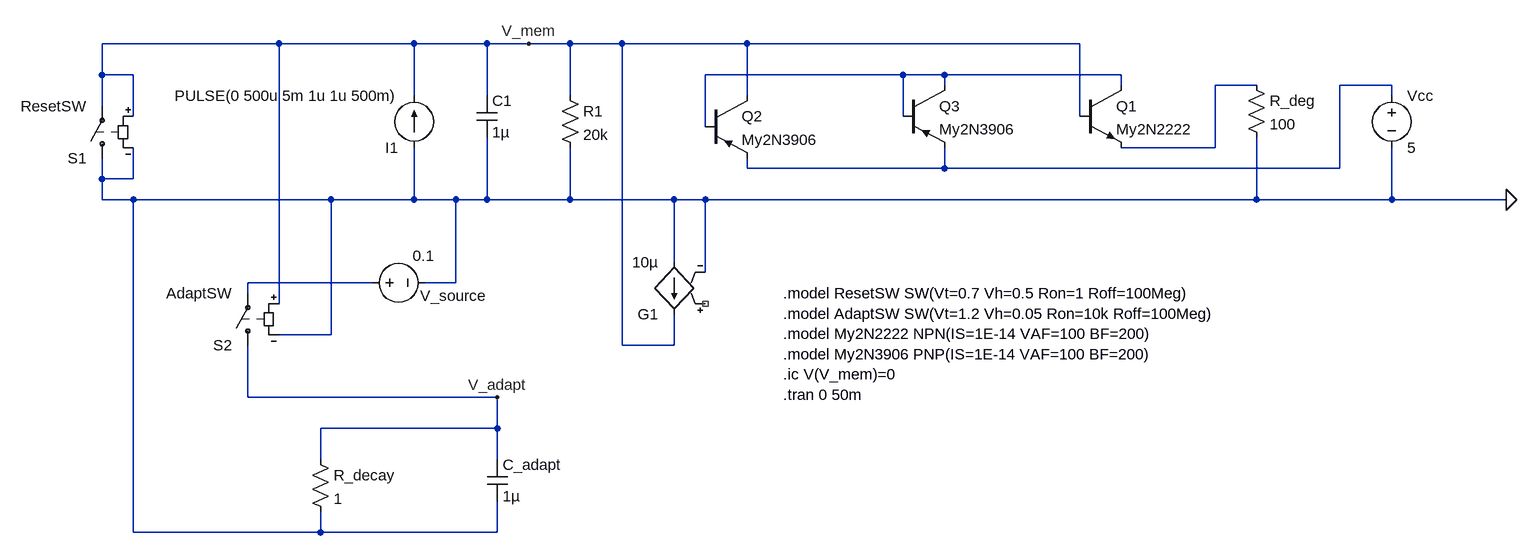
[diagram p0: schematic Adaptative_Neuron.asc]
Adaptative_Neuron.asc, the LTspice schematic file:
Version 4
SHEET 1 2152 2104
WIRE -1552 1344 -1824 1344
WIRE -1344 1344 -1552 1344
WIRE -1232 1344 -1344 1344
WIRE -1168 1344 -1232 1344
WIRE -1104 1344 -1168 1344
WIRE -1024 1344 -1104 1344
WIRE -832 1344 -1024 1344
WIRE -320 1344 -832 1344
WIRE -1824 1392 -1824 1344
WIRE -1776 1392 -1824 1392
WIRE -592 1392 -896 1392
WIRE -528 1392 -592 1392
WIRE -256 1392 -528 1392
WIRE -528 1408 -528 1392
WIRE -256 1408 -256 1392
WIRE -48 1408 -112 1408
WIRE 160 1408 80 1408
WIRE -1344 1424 -1344 1344
WIRE -1232 1424 -1232 1344
WIRE -1104 1424 -1104 1344
WIRE -832 1424 -832 1344
WIRE 160 1424 160 1408
WIRE -1824 1440 -1824 1392
WIRE -1776 1456 -1776 1392
WIRE -592 1456 -592 1392
WIRE -320 1456 -320 1344
WIRE -896 1472 -896 1392
WIRE -112 1504 -112 1408
WIRE -112 1504 -256 1504
WIRE -832 1536 -832 1520
WIRE -528 1536 -528 1504
WIRE -528 1536 -832 1536
WIRE 80 1536 80 1408
WIRE 80 1536 -528 1536
WIRE -1824 1552 -1824 1520
WIRE -1776 1552 -1776 1504
WIRE -1776 1552 -1824 1552
WIRE -1824 1584 -1824 1552
WIRE -1776 1584 -1824 1584
WIRE -1472 1584 -1776 1584
WIRE -1344 1584 -1344 1504
WIRE -1344 1584 -1472 1584
WIRE -1280 1584 -1344 1584
WIRE -1232 1584 -1232 1488
WIRE -1232 1584 -1280 1584
WIRE -1104 1584 -1104 1504
WIRE -1104 1584 -1232 1584
WIRE -944 1584 -1104 1584
WIRE -896 1584 -944 1584
WIRE -48 1584 -48 1488
WIRE -48 1584 -896 1584
WIRE 160 1584 160 1504
WIRE 160 1584 -48 1584
WIRE 336 1584 160 1584
WIRE -944 1680 -944 1584
WIRE -896 1696 -896 1584
WIRE -1408 1712 -1600 1712
WIRE -1280 1712 -1280 1584
WIRE -1280 1712 -1328 1712
WIRE -1600 1728 -1600 1712
WIRE -1552 1744 -1552 1344
WIRE -1472 1792 -1472 1584
WIRE -1472 1792 -1552 1792
WIRE -1024 1808 -1024 1344
WIRE -944 1808 -944 1760
WIRE -944 1808 -1024 1808
WIRE -1600 1888 -1600 1808
WIRE -1216 1888 -1600 1888
WIRE -1216 1936 -1216 1888
WIRE -1216 1936 -1488 1936
WIRE -1488 1984 -1488 1936
WIRE -1216 1984 -1216 1936
WIRE -1776 2096 -1776 1584
WIRE -1488 2096 -1488 2064
WIRE -1488 2096 -1776 2096
WIRE -1216 2096 -1216 2048
WIRE -1216 2096 -1488 2096
FLAG 336 1584 0
FLAG -1216 1888 V_adapt
FLAG -1168 1344 V_mem
SYMBOL cap -1248 1424 R0
SYMATTR InstName C1
SYMATTR Value 1µ
SYMBOL res -1120 1408 R0
SYMATTR InstName R1
SYMATTR Value 20k
SYMBOL current -1344 1504 R180
WINDOW 123 0 0 Left 0
WINDOW 39 0 0 Left 0
SYMATTR InstName I1
SYMATTR Value PULSE(0 500u 5m 1u 1u 500m)
SYMBOL pnp -896 1424 R0
SYMATTR InstName Q2
SYMATTR Value My2N3906
SYMBOL pnp -592 1408 R0
SYMATTR InstName Q3
SYMATTR Value My2N3906
SYMBOL voltage 160 1408 R0
WINDOW 123 0 0 Left 0
WINDOW 39 0 0 Left 0
SYMATTR InstName Vcc
SYMATTR Value 5
SYMBOL npn -320 1408 R0
SYMATTR InstName Q1
SYMATTR Value My2N2222
SYMBOL res -64 1392 R0
SYMATTR InstName R_deg
SYMATTR Value 100
SYMBOL sw -1824 1536 R180
SYMATTR InstName S1
SYMATTR Value ResetSW
SYMBOL sw -1600 1824 R180
SYMATTR InstName S2
SYMATTR Value AdaptSW
SYMBOL voltage -1424 1712 R270
WINDOW 123 0 0 Left 0
WINDOW 39 0 0 Left 0
WINDOW 0 -20 89 VRight 2
WINDOW 3 42 78 VRight 2
SYMATTR InstName V_source
SYMATTR Value 0.1
SYMBOL g -944 1776 R180
SYMATTR InstName G1
SYMATTR Value 10µ
SYMBOL cap -1232 1984 R0
SYMATTR InstName C_adapt
SYMATTR Value 1µ
SYMBOL res -1504 1968 R0
SYMATTR InstName R_decay
SYMATTR Value 1
TEXT -776 1728 Left 2 !.model ResetSW SW(Vt=0.7 Vh=0.5 Ron=1 Roff=100Meg)\n.model AdaptSW SW(Vt=1.2 Vh=0.05 Ron=10k Roff=100Meg)\n.model My2N2222 NPN(IS=1E-14 VAF=100 BF=200)\n.model My2N3906 PNP(IS=1E-14 VAF=100 BF=200)\n.ic V(V_mem)=0\n.tran 0 50m

The netlist it stands for:
* Adaptative_Neuron.asc
C1 V_mem 0 1µ
R1 V_mem 0 20k
I1 0 V_mem PULSE(0 500u 5m 1u 1u 500m)
Q2 V_mem N001 N003 0 My2N3906
Q3 N001 N001 N003 0 My2N3906
Vcc N003 0 5
Q1 N001 V_mem N002 0 My2N2222
R_deg N002 0 100
S1 0 V_mem V_mem 0 ResetSW
S2 V_adapt N004 V_mem 0 AdaptSW
V_source N004 0 0.1
G1 0 V_mem NC_01 0 10µ
C_adapt V_adapt 0 1µ
R_decay V_adapt 0 1
.model NPN NPN
.model PNP PNP
.lib standard.bjt
.model ResetSW SW(Vt=0.7 Vh=0.5 Ron=1 Roff=100Meg)
.model AdaptSW SW(Vt=1.2 Vh=0.05 Ron=10k Roff=100Meg)
.model My2N2222 NPN(IS=1E-14 VAF=100 BF=200)
.model My2N3906 PNP(IS=1E-14 VAF=100 BF=200)
.ic V(V_mem)=0
.tran 0 50m
.backanno
.end